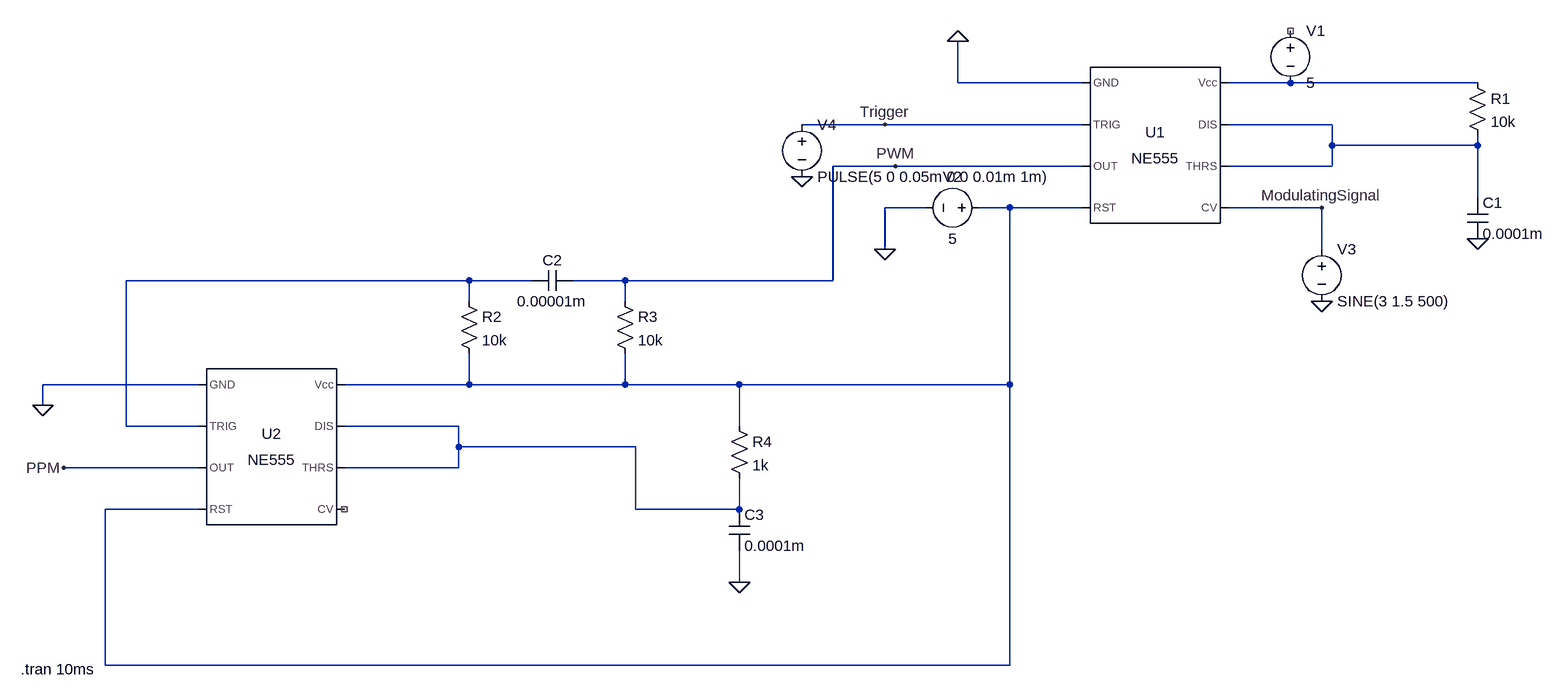
[diagram p0: schematic PWdemod.asc]
PWdemod.asc, the LTspice schematic file:
Version 4
SHEET 1 992 808
WIRE 80 -112 80 -176
WIRE 272 -112 80 -112
WIRE 592 -112 496 -112
WIRE 880 -112 592 -112
WIRE -32 -48 -160 -48
WIRE 272 -48 -32 -48
WIRE 656 -48 496 -48
WIRE 656 -16 656 -48
WIRE 880 -16 880 -32
WIRE 880 -16 656 -16
WIRE -16 16 -112 16
WIRE 272 16 -16 16
WIRE 656 16 656 -16
WIRE 656 16 496 16
WIRE 880 64 880 -16
WIRE 32 80 -32 80
WIRE 160 80 112 80
WIRE 272 80 160 80
WIRE 640 80 496 80
WIRE -32 144 -32 80
WIRE 640 144 640 80
WIRE -672 192 -1200 192
WIRE -576 192 -672 192
WIRE -432 192 -512 192
WIRE -112 192 -112 16
WIRE -112 192 -432 192
WIRE -672 224 -672 192
WIRE -432 224 -432 192
WIRE -1088 352 -1328 352
WIRE -672 352 -672 304
WIRE -672 352 -864 352
WIRE -432 352 -432 304
WIRE -432 352 -672 352
WIRE -256 352 -432 352
WIRE 160 352 160 80
WIRE 160 352 -256 352
WIRE -1328 384 -1328 352
WIRE -1200 416 -1200 192
WIRE -1088 416 -1200 416
WIRE -688 416 -864 416
WIRE -256 416 -256 352
WIRE -688 448 -688 416
WIRE -416 448 -688 448
WIRE -1088 480 -1296 480
WIRE -688 480 -688 448
WIRE -688 480 -864 480
WIRE -1088 544 -1232 544
WIRE -416 544 -416 448
WIRE -256 544 -256 496
WIRE -256 544 -416 544
WIRE -256 656 -256 608
WIRE -1232 784 -1232 544
WIRE 160 784 160 352
WIRE 160 784 -1232 784
FLAG 80 -176 0
FLAG 880 128 0
FLAG -16 16 PWM
FLAG -160 32 0
FLAG 640 224 0
FLAG -32 -48 Trigger
FLAG 640 80 ModulatingSignal
FLAG -32 144 0
FLAG -1328 384 0
FLAG -256 656 0
FLAG -1296 480 PPM
SYMBOL Misc\\NE555 384 -16 R0
SYMATTR InstName U1
SYMBOL res 864 -128 R0
SYMATTR InstName R1
SYMATTR Value 10k
SYMBOL cap 864 64 R0
SYMATTR InstName C1
SYMATTR Value 0.0001m
SYMBOL voltage 592 -208 R0
WINDOW 123 0 0 Left 0
WINDOW 39 0 0 Left 0
SYMATTR InstName V1
SYMATTR Value 5
SYMBOL voltage 128 80 R90
WINDOW 0 -32 56 VBottom 2
WINDOW 3 32 56 VTop 2
WINDOW 123 0 0 Left 0
WINDOW 39 0 0 Left 0
SYMATTR InstName V2
SYMATTR Value 5
SYMBOL voltage 640 128 R0
WINDOW 123 0 0 Left 0
WINDOW 39 0 0 Left 0
SYMATTR InstName V3
SYMATTR Value SINE(3 1.5 500)
SYMBOL voltage -160 -64 R0
WINDOW 123 0 0 Left 0
WINDOW 39 0 0 Left 0
SYMATTR InstName V4
SYMATTR Value PULSE(5 0 0.05m 0 0 0.01m 1m)
SYMBOL Misc\\NE555 -976 448 R0
SYMATTR InstName U2
SYMBOL cap -512 176 R90
WINDOW 0 0 32 VBottom 2
WINDOW 3 32 32 VTop 2
SYMATTR InstName C2
SYMATTR Value 0.00001m
SYMBOL res -688 208 R0
SYMATTR InstName R2
SYMATTR Value 10k
SYMBOL res -448 208 R0
SYMATTR InstName R3
SYMATTR Value 10k
SYMBOL res -272 400 R0
SYMATTR InstName R4
SYMATTR Value 1k
SYMBOL cap -272 544 R0
SYMATTR InstName C3
SYMATTR Value 0.0001m
TEXT -1362 790 Left 2 !.tran 10ms

The netlist it stands for:
* PWdemod.asc
XU1 0 Trigger PWM N003 ModulatingSignal N002 N002 N001 NE555  ; pins GND TRIG OUT RST CV THRS DIS Vcc
R1 N001 N002 10k
C1 N002 0 0.0001m
V1 NC_01 N001 5
V2 N003 0 5
V3 ModulatingSignal 0 SINE(3 1.5 500)
V4 Trigger 0 PULSE(5 0 0.05m 0 0 0.01m 1m)
XU2 0 N004 PPM N003 NC_02 N005 N005 N003 NE555  ; pins GND TRIG OUT RST CV THRS DIS Vcc
C2 PWM N004 0.00001m
R2 N004 N003 10k
R3 PWM N003 10k
R4 N003 N005 1k
C3 N005 0 0.0001m
.tran 10ms
.lib NE555.sub
.backanno
.end